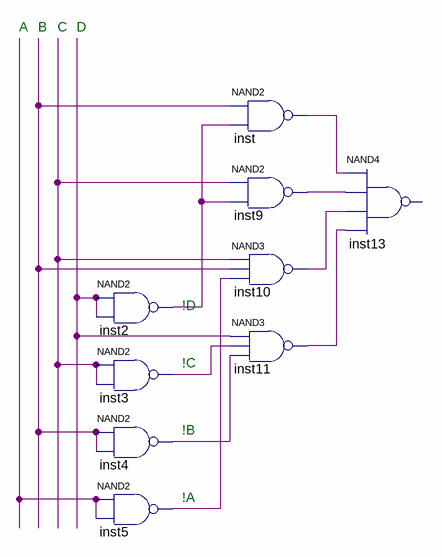
[diagram p0: schematic sheet]
// Quartus schematic lalalla.bdf as structural Verilog: 9 symbols, 0 pins
module lalalla (
);

  wire inst2_out, inst3_out, inst4_out, inst5_out, inst9_out, inst10_out, inst11_out, inst_out, undriven,
       undriven_2, undriven_3, undriven_4;

  nand inst2 (inst2_out, undriven_4, undriven_4);
  nand inst3 (inst3_out, undriven_2, undriven_2);
  nand inst4 (inst4_out, undriven_3, undriven_3);
  nand inst5 (inst5_out, undriven, undriven);
  nand inst (inst_out, undriven_3, inst2_out);
  nand inst9 (inst9_out, undriven_2, inst2_out);
  nand inst10 (inst10_out, undriven_2, undriven_3, inst5_out);
  nand inst11 (inst11_out, undriven_4, inst3_out, inst4_out);
  // NAND4 inst13 has open pins: IN1=inst_out, IN2=inst9_out, IN3=inst10_out, IN4=inst11_out, OUT=open

  // Notes on the sheet:
  //   A
  //   B
  //   C
  //   D
  //   !D
  //   !C
  //   !B
  //   !A
endmodule
